# Altium schematic sheet schematic.SchDoc
size Letter
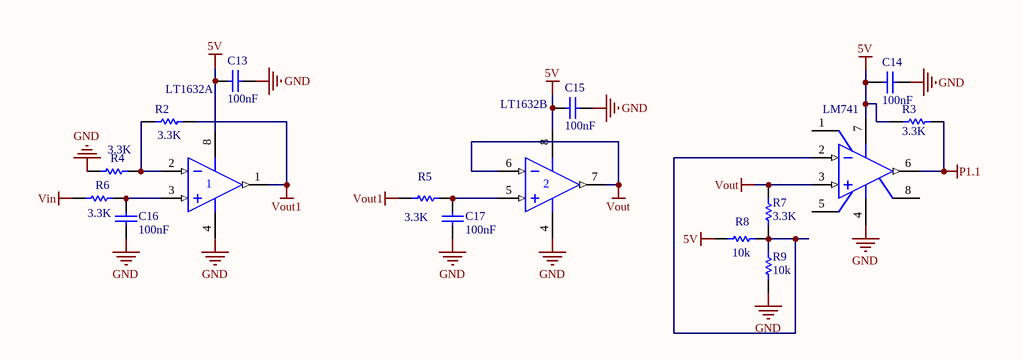
[diagram p0: schematic.SchDoc]

## Parts
C13  value 100nF  [RAD-0.1]  (hidden comment: Cap)
C14  value 100nF  [RAD-0.1]  (hidden comment: Cap)
C15  value 100nF  [RAD-0.1]  (hidden comment: Cap)
C16  value 100nF  [RAD-0.1]  (hidden comment: Cap)
C17  value 100nF  [RAD-0.1]  (hidden comment: Cap)
LM741  LM741CN  [N08E]  (value not drawn)
LT1632  LT1632  [JG008]  (value not drawn)  (parts A,B of 2)
R2  value 3.3K  [AXIAL-0.3]  (hidden comment: Res1)
R3  value 3.3K  [AXIAL-0.3]  (hidden comment: Res1)
R4  value 3.3K  [AXIAL-0.3]  (hidden comment: Res1)
R5  value 3.3K  [AXIAL-0.3]  (hidden comment: Res1)
R6  value 3.3K  [AXIAL-0.3]  (hidden comment: Res1)
R7  value 3.3K  [AXIAL-0.3]  (hidden comment: Res1)
R8  value 10k  [AXIAL-0.3]  (hidden comment: Res1)
R9  value 10k  [AXIAL-0.3]  (hidden comment: Res1)

## Nets
5V: C13.2 C14.2 C15.2 LM741.7(V+) LT1632.8(V+) R3.2 R8.1
GND: C13.1 C14.1 C15.1 C16.2 C17.2 LM741.4(V-) LT1632.4(V-) R4.1 R9.1
P1.1: LM741.6(OUT) R3.1
Vin: R6.1
Vout: LM741.3(IN+) LT1632.6(IN-) LT1632.7(OUT) R7.2
Vout1: LT1632.1(OUT) R2.2 R5.1
NetC16_1: C16.1 LT1632.3(IN+) R6.2
NetC17_1: C17.1 LT1632.5(IN+) R5.2
NetLM741_2: LM741.2(IN-) R7.1 R8.2 R9.2
NetLT1632_2: LT1632.2(IN-) R2.1 R4.2

Not connected (* = marked no-connect by the designer): LM741 1(OFS_NULL) 5(OFS_NULL) 8(NC)

## Library data of the parts
C13-C17 = Cap: Capacitor; Published: 8-Jun-2000; LatestRevisionDate: 17-Jul-2002; LatestRevisionNote: Re-released for DXP Platform.; PackageReference: RAD-0.3; Publisher: Altium Limited; PackageDescription: Radial Cap, Thru-Hole; 2 Leads; 0.3 in Pin Spacing
LM741 = LM741CN: Operational Amplifier, 8-pin MDIP; Manufacturer: National Semiconductor; PackageTopMarking: NSUZXYTTE#*LM*741CN; PowerWise: N; CompType: Amplifiers; Published: 4-Dec-2008; LatestRevisionDate: 13-Jan-2009; LatestRevisionNote: Sim Model Added.; DatasheetVersion: Aug-2000; PackageVersion: revG, May-2006; PackageReference: N08E; Publisher: Altium Limited; PackageDescription: MDIP, .365 x .250 x .130in, 8 Lead, .100in Pitch; Supplier 1: Farnell; Supplier Part Number 1: 1523833; Supplier 2: Farnell; Supplier Part Number 2: 9486780; PartNumber: LM741CN; RoHS: N; PinCount: 8; Code_JEDEC: MS-001-BA; ComponentLink1Description: LM741 Datasheet; ComponentLink1URL: http://www.national.com/ds/LM/LM741.pdf; ComponentLink2Description: LM741 Web Page; ComponentLink2URL: http://www.national.com/pf/LM/LM741.html; ComponentLink3Description: N08E Package Page; ComponentLink3URL: http://www.national.com/packaging/folders/n08e.html
LT1632 = LM158JG: Dual Operational Amplifier; Published: 15-Apr-2002; LatestRevisionDate: 04-Mar-2005; LatestRevisionNote: Stylized 3D Model Added.; DatasheetVersion: Aug-1988; PackageVersion: Jan-1995; PackageReference: JG008; Publisher: Altium Limited; PackageDescription: DIP; 8 Leads; Row Spacing 7.62 mm; Pitch 2.54 mm; ComponentLink1Description: Manufacturer Link; ComponentLink1URL: http://www.ti.com/; ComponentLink2Description: Datasheet; ComponentLink2URL: http://www-s.ti.com/sc/ds/lm158.pdf
R2-R9 = Res1: Resistor; Published: 8-Jun-2000; LatestRevisionDate: 17-Jul-2002; LatestRevisionNote: Re-released for DXP Platform.; PackageReference: AXIAL-0.3; Publisher: Altium Limited; PackageDescription: Axial Device, Thru-Hole; 2 Leads; 0.3 in Pin Spacing